# EAGLE schematic source_eagle (EAGLE 9.6.2)
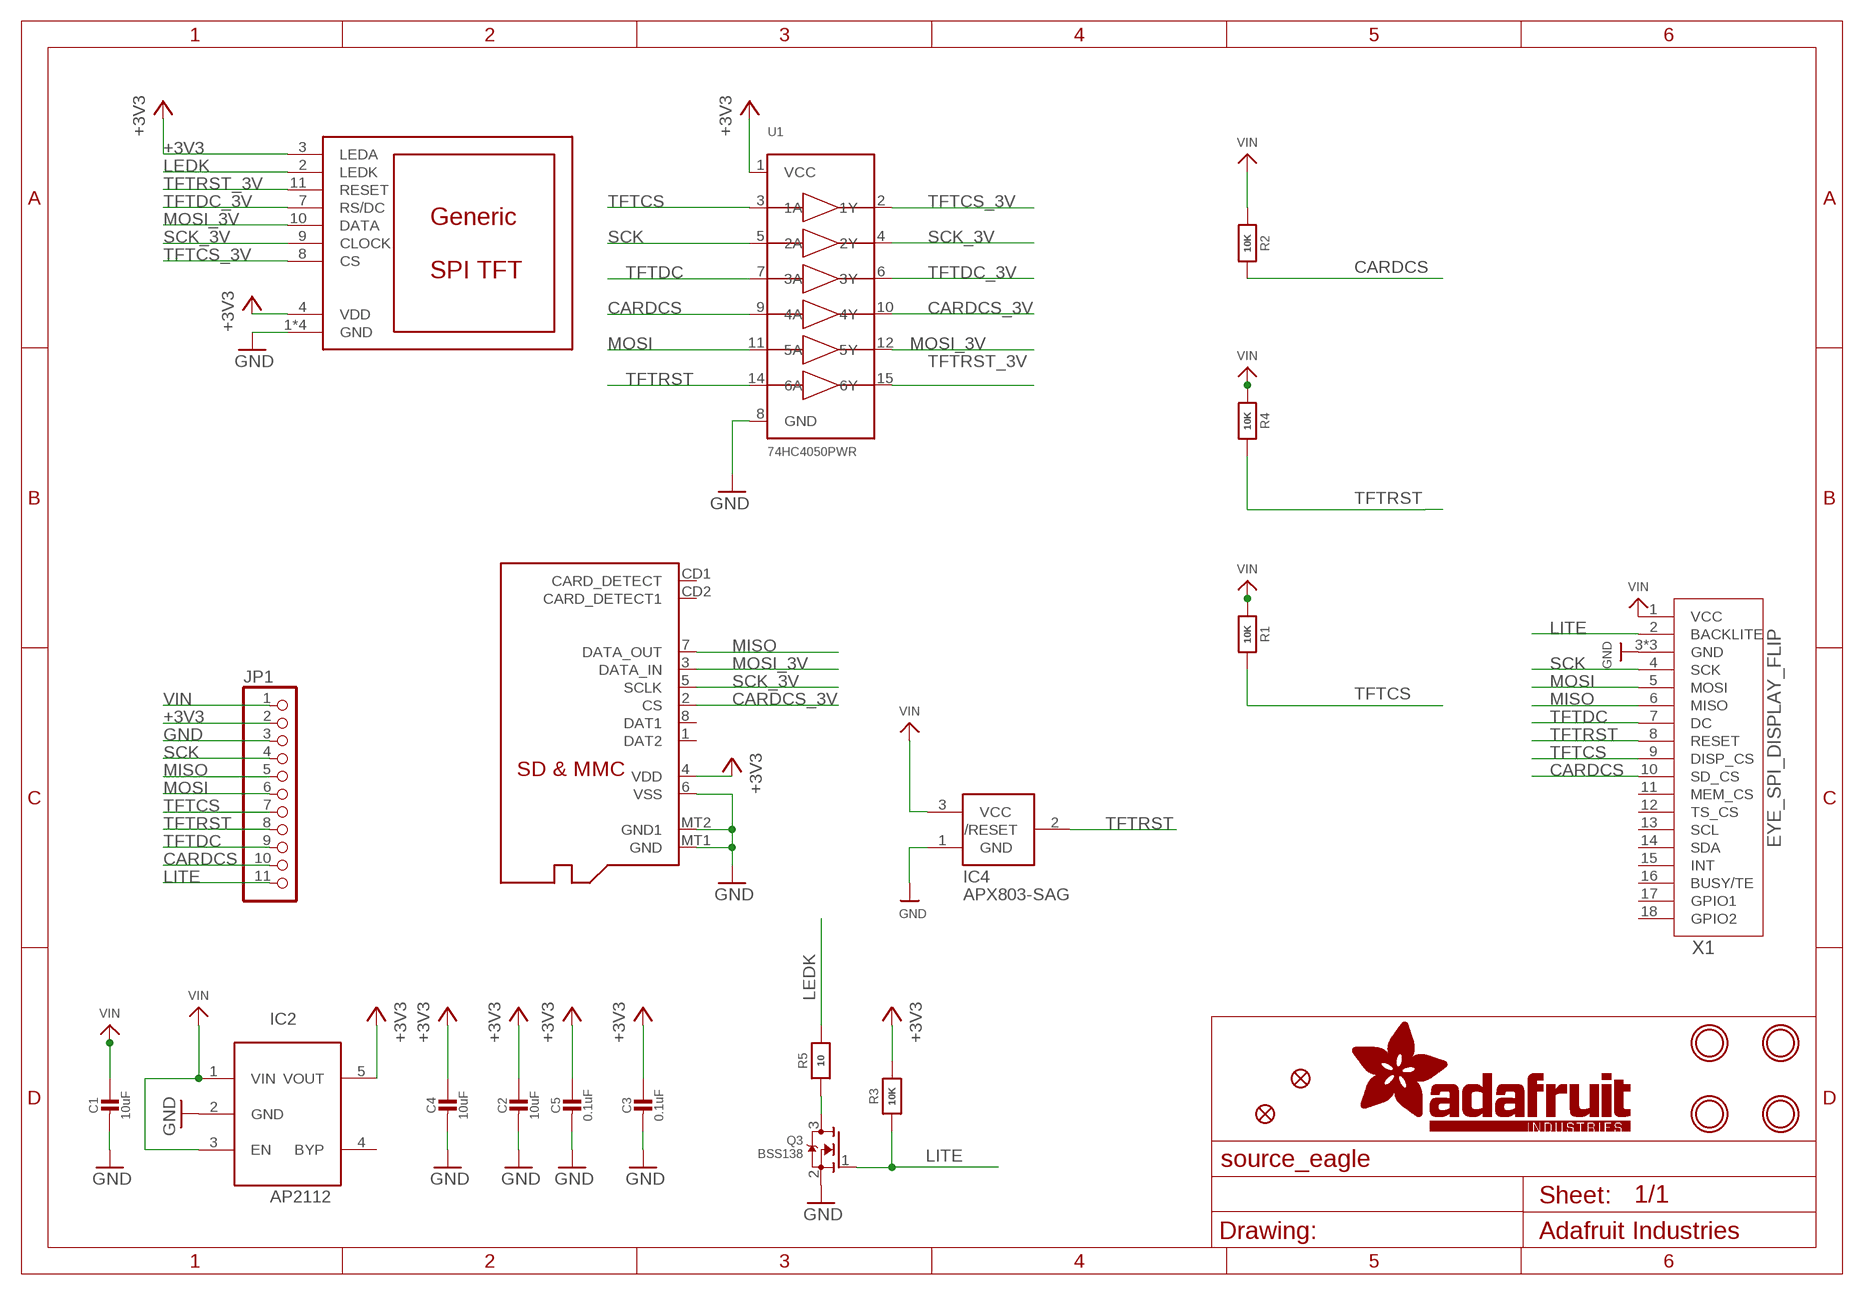
[diagram p0: schematic, sheet 1]

## Parts
C1  10uF  CAP_CERAMIC0805-NOOUTLINE  [0805-NO]
C2  10uF  CAP_CERAMIC0805-NOOUTLINE  [0805-NO]
C3  0.1uF  CAP_CERAMIC0603_NO  [0603-NO]
C4  10uF  CAP_CERAMIC0805-NOOUTLINE  [0805-NO]
C5  0.1uF  CAP_CERAMIC0603_NO  [0603-NO]
DISP1  DISP_LCD_GENERIC_SPI_1.69_WRAPUNDER  [TFT_1.69IN_240X280_12P]
IC2  AP2112  LP298XS  [SOT23-5L]
IC4  APX803-SAG  AXP083-SAG  [SOT23]
JP1  HEADER-1X1176MIL  [1X11_ROUND_76]
Q2  MICROSD  [MICROSD]
Q3  BSS138  MOSFET-NWIDE  [SOT23-WIDE]
R1  10K  RESISTOR_0603_NOOUT  [0603-NO]
R2  10K  RESISTOR_0603_NOOUT  [0603-NO]
R3  10K  RESISTOR_0603_NOOUT  [0603-NO]
R4  10K  RESISTOR_0603_NOOUT  [0603-NO]
R5  10  RESISTOR_0603_NOOUT  [0603-NO]
U1  74HC4050PWR  74HC4050DTSSOP  [TSSOP16]
U$4  FIDUCIAL_1MM  [FIDUCIAL_1MM]
U$5  FIDUCIAL_1MM  [FIDUCIAL_1MM]
U$7  MOUNTINGHOLE2.5  [MOUNTINGHOLE_2.5_PLATED]
U$8  MOUNTINGHOLE2.5  [MOUNTINGHOLE_2.5_PLATED]
U$9  MOUNTINGHOLE2.5  [MOUNTINGHOLE_2.5_PLATED]
U$10  MOUNTINGHOLE2.5  [MOUNTINGHOLE_2.5_PLATED]
X1  EYE_SPI_DISPLAY_FLIP  [EYE_SPI_DISPLAY_BOTCONTACT]

## Nets
+3V3 [power]: C2.1 C3.1 C4.1 C5.1 DISP1.3(LEDA) DISP1.4(VDD) IC2.5(VOUT) JP1.2 Q2.4(VDD) R3.2 U1.1(VCC)
CARDCS: JP1.10 R2.1 U1.9(4A) X1.10(SD_CS)
CARDCS_3V: Q2.2(CS) U1.10(4Y)
GND: C1.2 C2.2 C3.2 C4.2 C5.2 DISP1.1(GND) DISP1.5(GND) DISP1.6(GND) DISP1.12(GND) IC2.2(GND) IC4.1(GND) JP1.3 Q2.6(VSS) Q2.MT1(GND) Q2.MT2(GND1) Q3.2(S) U1.8(GND) X1.3(GND) X1.SUPPORT1(GND) X1.SUPPORT2(GND)
LEDK: DISP1.2(LEDK) R5.2
LITE: JP1.11 Q3.1(G) R3.1 X1.2(BACKLITE)
MISO: JP1.5 Q2.7(DATA_OUT) X1.6(MISO)
MOSI: JP1.6 U1.11(5A) X1.5(MOSI)
MOSI_3V: DISP1.10(DATA) Q2.3(DATA_IN) U1.12(5Y)
N$1: Q3.3(D) R5.1
SCK: JP1.4 U1.5(2A) X1.4(SCK)
SCK_3V: DISP1.9(CLOCK) Q2.5(SCLK) U1.4(2Y)
TFTCS: JP1.7 R1.1 U1.3(1A) X1.9(DISP_CS)
TFTCS_3V: DISP1.8(CS) U1.2(1Y)
TFTDC: JP1.9 U1.7(3A) X1.7(DC)
TFTDC_3V: DISP1.7(RS/DC) U1.6(3Y)
TFTRST: IC4.2(/RESET) JP1.8 R4.1 U1.14(6A) X1.8(RESET)
TFTRST_3V: DISP1.11(RESET) U1.15(6Y)
VIN [power]: C1.1 IC2.1(VIN) IC2.3(EN) IC4.3(VCC) JP1.1 R1.2 R2.2 R4.2 X1.1(VCC)
Unconnected: IC2.4(BYP) Q2.1(DAT2) Q2.8(DAT1) Q2.CD1(CARD_DETECT) Q2.CD2(CARD_DETECT1) X1.11(MEM_CS) X1.12(TS_CS) X1.13(SCL) X1.14(SDA) X1.15(INT) X1.16(BUSY/TE) X1.17(GPIO1) X1.18(GPIO2)

## Library data of the parts
C1-C5 = microbuilder:CAP_CERAMIC: Ceramic Capacitors For new designs, use the packages preceded by an '_' character since they are more reliable: The following footprints should be used on most boards: _0402 - Standard footprint for regular board layouts _0603 - Standard footprint for regular board layouts _0805 - Standard footprint for regular board layouts _1206 - Standard footprint for regular board layouts For extremely tight-pitch boards where space is at a premium, the following 'micro-pitch' footprints can be used (smaller pads, no silkscreen outline, etc.): _0402MP - Micro-pitch footprint for very dense/compact boards _0603MP - Micro-pitch footprint for very dense/compact boards _0805MP - Micro-pitch footprint for very dense/compact boards _1206MP - Micro-pitch footprint for very dense/compact boards
DISP1 = adafruit_display:DISP_LCD_GENERIC_SPI
IC2 = adafruit:LP298X
IC4 = adafruit:AXP083
JP1 = microbuilder:HEADER-1X11
Q2 = adafruit:MICROSD: Micro-SD / Transflash card holder with SPI pinout For the 3M # 2908-05WB-MG and/or 4UCON #19656 push-push type
Q3 = microbuilder:MOSFET-N: N-Channel Mosfet LEGEND VDS: Voltage Drain-Source ID: Drain Current RDS(ON): Drain-Source On-State Resistance VGS(TH): Gate-Source Threshold Voltage CISS: Drain-Source Input Capacitance SOT-23 Name VDS ID RDS(ON) VGS(TH) CISS Order Number 2N7002E 60V 260mA 2.5 Ohm 2.5V @ 250uA 26.7pF @ 25V 2N7002ET1GOSTR-ND BSH103 30V 850mA 400 mOhm 400mV @ 1mA 83pF @ 24V BSH103,235-ND BSS138 60V 320mA 1.6 Ohm 1.5V @ 250uA 50pF @ 10V Mouser: 771-BSS138PW115 DMN2075U-7 20V 4.2A 38 mOhm 1V @ 250 uA 594.3pF @ 10V DMN2075U-7DICT-ND * BSS138 good choice for I2C level-shifting POWERPAK 1212-8 Name VDS ID RDS(ON) VGS(TH) CISS Order Number Si7308DN 60V 6A 58 mOhm 3V @ 250uA 665pF @ 15V SI7308DN-T1-E3CT-ND
R1-R5 = microbuilder:RESISTOR: Resistors For new designs, use the packages preceded by an '_' character since they are more reliable: The following footprints should be used on most boards: _0402 - Standard footprint for regular board layouts _0603 - Standard footprint for regular board layouts _0805 - Standard footprint for regular board layouts _1206 - Standard footprint for regular board layouts For extremely tight-pitch boards where space is at a premium, the following 'micro-pitch' footprints can be used (smaller pads, no silkscreen outline, etc.): _0402MP - Micro-pitch footprint for very dense/compact boards _0603MP - Micro-pitch footprint for very dense/compact boards _0805MP - Micro-pitch footprint for very dense/compact boards _1206MP - Micro-pitch footprint for very dense/compact boards
U1 = microbuilder:74HC4050D: 6-channel level shifter 74HC4050D - 2V-6V Supply SOIC16 Digikey: 74HC4050D,653-ND Mouser: 771-74HC4050D-T TSSOP16 Digikey: 296-9215-1-ND Mouser:
U$4 U$5 = microbuilder:FIDUCIAL: Fiducial Alignment Points Various fiducial points for machine vision alignment.; BOM: EXCLUDE
U$7-U$10 = microbuilder:MOUNTINGHOLE: Mounting Hole For #2 screws (0.086"/2.18mm width, 0.094"/2.4mm hole) use 2.5mm; BOM: EXCLUDE
X1 = adafruit_display:EYE_SPI_DISPLAY

## Net classes
1 power: width 0.254 mm